# EAGLE design APC (EAGLE 9.6.2)
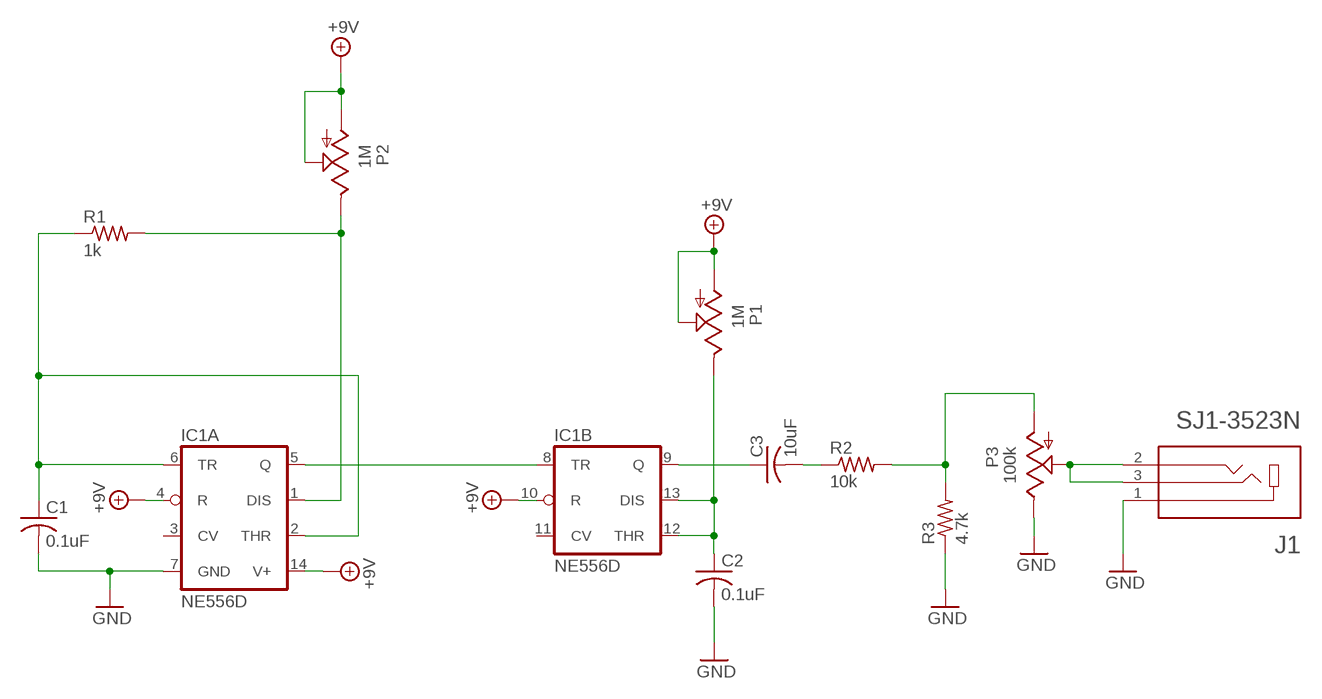
[diagram p0: schematic, sheet 1]

## Parts
C1  0.1uF  C-USC0805  [C0805]
C2  0.1uF  C-USC0805  [C0805]
C3  10uF  C-USC0805  [C0805]
IC1  NE556D  [SO14]
J1  SJ1-3523N  [CUI_SJ1-3523N]
P1  1M  TRIM_US-PT10  [PT-10]
P2  1M  TRIM_US-PT10  [PT-10]
P3  100k  TRIM_US-PT10  [PT-10]
R1  1k  R-US_R0805  [R0805]
R2  10k  R-US_R0805  [R0805]
R3  4.7k  R-US_R0805  [R0805]

## Nets
+9V: IC1.4(A:R) IC1.10(B:R) IC1.14(A:V+) P1.A P1.S P2.A P2.S
GND: C1.2 C2.2 IC1.7(A:GND) J1.1 P3.E R3.1
N$1: IC1.5(A:Q) IC1.8(B:TR)
N$2: C1.1 IC1.2(A:THR) IC1.6(A:TR) R1.1
N$3: C2.1 IC1.12(B:THR) IC1.13(B:DIS) P1.E
N$4: IC1.1(A:DIS) P2.E R1.2
N$5: C3.2 R2.1
N$6: C3.1 IC1.9(B:Q)
N$9: J1.2 J1.3 P3.S
N$10: P3.A R2.2 R3.2
Unconnected: IC1.3(A:CV) IC1.11(B:CV)

## Library data of the parts
C1-C3 = rcl:C-US: CAPACITOR, American symbol; SPICEPREFIX: C
IC1 = linear:*556: Dual TIMER
J1 = SJ1-3523N:SJ1-3523N: 3.5 mm Right-Angle Stereo Jack, 3 Pin PCB Mount, Non-Threaded; CUI_PURCHASE_URL: https://www.cuidevices.com/product/interconnect/connectors/audio-connectors/jacks/sj1-352xn-series?utm_source=snapeda.com&utm_medium=referral&utm_campaign=snapedaBOM; DESCRIPTION: 3.5 mm, Stereo, Right Angle, Through Hole, 3 Conductors, 0~2 Internal Switches, Audio Jack Connector; DIGI-KEY_PART_NUMBER: CP1-3523NG-ND; MF: CUI Devices; MP: SJ1-3523N; PACKAGE: None; PURCHASE-URL: https://pricing.snapeda.com/search/part/SJ1-3523N/?ref=eda
P1-P3 = pot:TRIM_US-: POTENTIOMETER
R1-R3 = rcl:R-US_: RESISTOR, American symbol; SPICEPREFIX: R

## Board
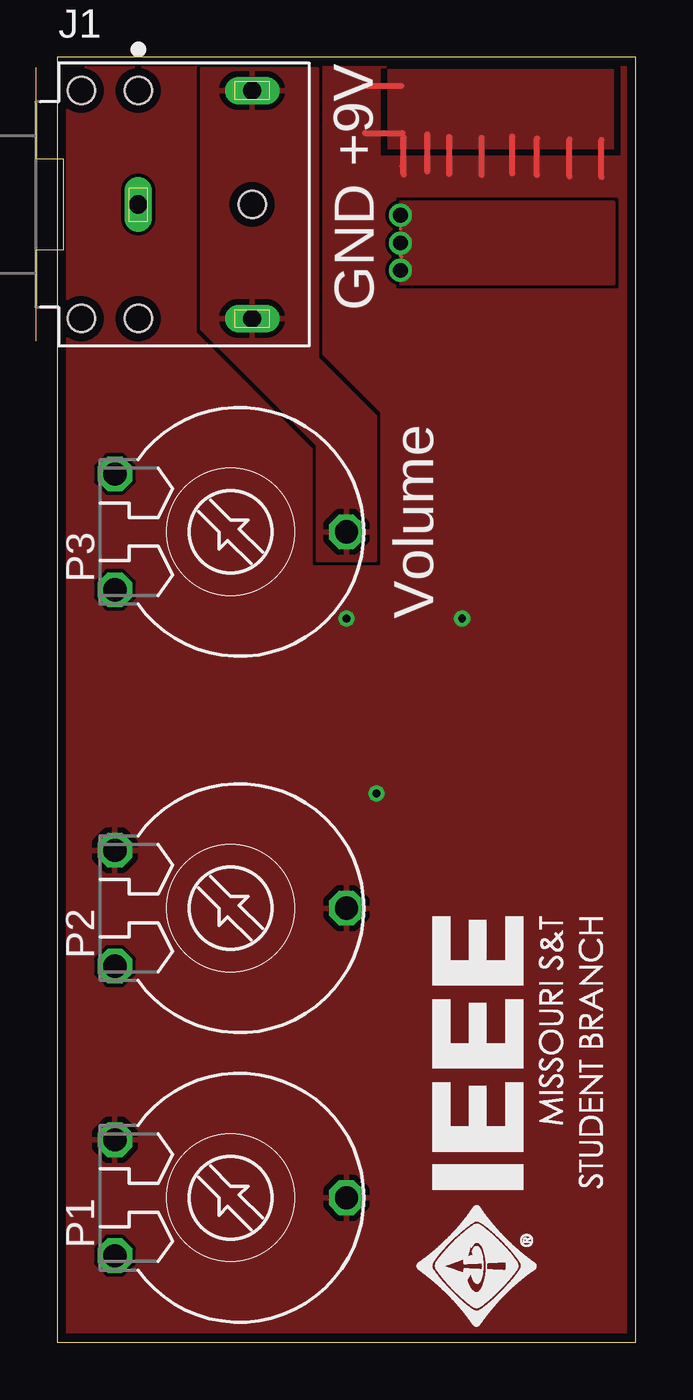
[diagram p1: board, top side]
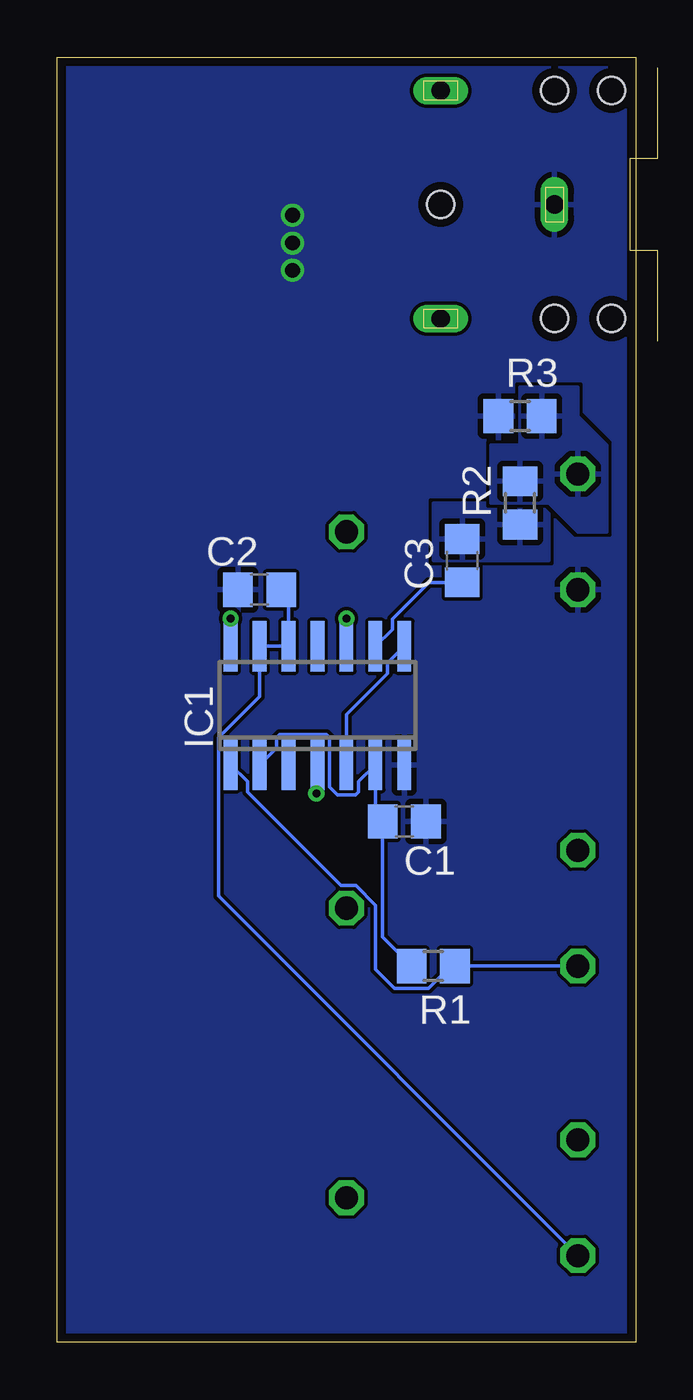
[diagram p2: board, bottom side, seen from below]

Size 25.4 x 56.39 mm. Coordinates in mm from the lower left corner, seen from the top.
Outline: 0,0 25.4,0 25.4,56.39 0,56.39 0,0
Copper layers (1*16): Top 0.0356mm / dielectric 1.5011mm / Bottom 0.0356mm
Design rules "OSH_PCB Rules": minimum track width 6mil, minimum drill 13mil, track to track 6mil, track to pad 6mil, pad to pad 6mil, via to via 6mil, smd to smd 6mil, copper to edge 15mil, drill to drill 6mil, minimum pad ring 7mil, minimum via ring 7mil, stop-mask expansion 3mil, vias tented up to drill 0mil, thermal gap 10mil

### Footprints (pad centres in the part's own frame; a part is rotated, then mirrored left to right if it is on the bottom)
C0805 = smd 1.3 x 1.5: 1 -0.95,0; 2 0.95,0
SO14 = smd 0.6 x 2.2: 1 -3.81,-2.6; 2 -2.54,-2.6; 3 -1.27,-2.6; 4 0,-2.6; 5 1.27,-2.6; 6 2.54,-2.6; 7 3.81,-2.6; 8 3.81,2.6; 9 2.54,2.6; 10 1.27,2.6; 11 0,2.6; 12 -1.27,2.6; 13 -2.54,2.6; 14 -3.81,2.6
CUI_SJ1-3523N = drill 0.8 long: 1 0,0; 2 5,-5; 3 5,5 | hole 1.2: -2.5,5; 0,5; 5,0; -2.5,-5; 0,-5
PT-10 = drill 1.016 octagon: A -2.54,-5.08; E 2.54,-5.08; S 0,5.08
R0805 = smd 1.3 x 1.5: 1 -0.95,0; 2 0.95,0

### Placement (x,y rotation side)
C1  10.16,22.86 0 bottom
C2  16.51,33.02 180 bottom
C3  7.62,34.29 90 bottom
IC1  13.97,27.94 0 bottom
J1  3.57,49.92 0 top
P1  7.62,6.35 270 top
P2  7.62,19.05 270 top
P3  7.62,35.56 270 top
R1  8.89,16.51 0 bottom
R2  5.08,36.83 90 bottom
R3  5.08,40.64 0 bottom

### Tracks (layer width: path | path; a pad name or v marks a point on that pad's centre or on a via)
+9V  (via drill 0.35)
  Top 0.152: 15.1,55.17 15.1,55.12 | 15.1,51.6 15.13,51.57
  Top 0.254: 13.48,55.12 15.1,55.12 | 13.52,53.06 15.14,53.06 | 16.25,51.37 16.25,52.98 | 19.98,51.28 19.98,52.89 | 23.9,51.13 23.9,52.75 | 22.48,51.16 22.48,52.77 | 21.06,51.21 21.06,52.82 | 18.64,51.22 18.64,52.83 | 17.21,51.26 17.21,52.87 | 15.21,51.25 15.21,52.86
  Bottom 0.152: IC1.10 v12.7,31.75 | IC1.14 v17.78,31.75 | IC1.4 14.02,25.29 v14.02,24.08
  pour Top (rank 6): -1.27,58.42 -1.27,-2.54 26.67,-2.54 26.67,58.42
  cutout Top: 14.22,55.88 14.22,52.07 14.48,52.07 14.48,55.88
  pour Top: 14.49,55.87 14.49,52.34 24.43,52.34 24.43,55.85 14.51,55.85
  cutout Top: 14.48,55.88 24.71,55.88 24.71,56.02 14.48,56.02
  cutout Top: 14.49,52.07 24.72,52.07 24.72,52.33 14.49,52.33
  cutout Top: 24.46,55.88 24.46,52.07 24.71,52.07 24.71,55.88
GND  (via drill 0.65)
  Top 0.152: 15.07,47.68 15.11,47.64 | 15.07,48.85 | v15.07,47.03
  other vias: 15.07,48.23 15.07,49.45
  pour Bottom (rank 6): 0,56.73 0,-1.27 25.4,-1.27 25.4,56.73
  pour Top: 15.07,50.03 15.07,46.44 24.44,46.44 24.44,50.02
N$1
  Bottom 0.152: IC1.8 10.9,29.8 10.9,29.35 12.7,27.55 IC1.5
N$2
  Bottom 0.152: IC1.2 15.77,26.08 15.77,26.54 15.63,26.67 13.57,26.67 13.44,26.54 13.44,24.36 13.1,24.01 12.3,24.01 12.17,24.15 12.17,24.6 IC1.6 11.43,23.18 C1.1 11.11,17.78 R1.1
N$3
  Bottom 0.152: C2.1 15.24,32.7 IC1.12 IC1.13 16.51,28.33 18.31,26.54 18.31,19.58 P1.E
N$4
  Bottom 0.152: P2.E 7.62,16.51 R1.2 8.12,16.51 9.1,15.53 10.59,15.53 11.41,16.36 11.41,19.17 12.29,20.04 12.93,20.04 17.04,24.15 17.04,24.6 IC1.1
N$5
  pour Bottom (rank 2): 3.81,36.83 3.81,34.29 8.89,34.29 8.89,36.83
N$6
  Bottom 0.152: IC1.9 10.69,31.28 10.69,31.74 9.08,33.34 C3.1
N$9
  pour Top: 11.43,34.29 11.43,39.37 6.35,44.45 6.35,55.88 11.43,55.88 11.43,43.18 13.97,40.64 13.97,34.29
N$10
  pour Bottom: 2.54,40.64 1.27,39.37 1.27,35.56 2.54,35.56 3.81,36.83 6.35,36.83 6.35,39.37 5.08,39.37 5.08,41.91 2.54,41.91

### Text on the board
tNames: +9V | GND | Volume